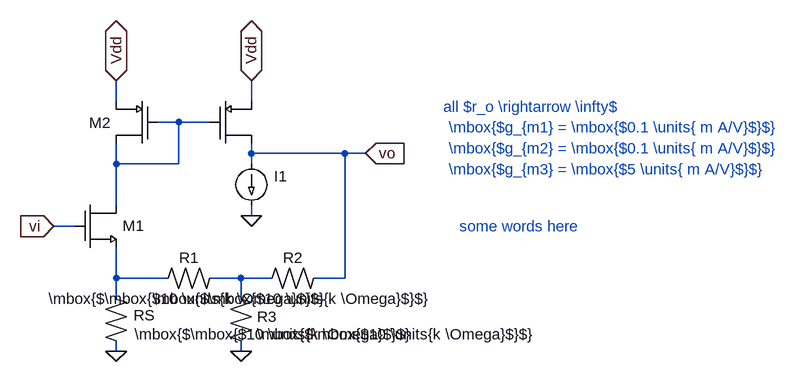
[diagram p0: schematic exampleLatex.asc]
exampleLatex.asc, the LTspice schematic file:
Version 4
SHEET 1 1120 680
WIRE -1008 128 -1008 96
WIRE -800 128 -800 96
WIRE -912 160 -944 160
WIRE -864 160 -912 160
WIRE -800 208 -800 192
WIRE -656 208 -800 208
WIRE -624 208 -656 208
WIRE -1008 224 -1008 192
WIRE -912 224 -912 160
WIRE -912 224 -1008 224
WIRE -800 224 -800 208
WIRE -1008 288 -1008 224
WIRE -800 304 -800 288
WIRE -1072 320 -1104 320
WIRE -1008 400 -1008 352
WIRE -928 400 -1008 400
WIRE -816 400 -864 400
WIRE -768 400 -816 400
WIRE -656 400 -656 208
WIRE -656 400 -704 400
WIRE -1008 432 -1008 400
WIRE -816 432 -816 400
WIRE -1008 512 -1008 496
WIRE -816 512 -816 496
FLAG -800 96 Vdd
IOPIN -800 96 BiDir
FLAG -1008 96 Vdd
IOPIN -1008 96 BiDir
FLAG -800 304 0
FLAG -624 208 vo
IOPIN -624 208 In
FLAG -1104 320 vi
IOPIN -1104 320 In
FLAG -816 512 0
FLAG -1008 512 0
SYMBOL svg_pmos -864 112 R0
WINDOW 0 70 47 Invisible 2
SYMATTR InstName M3
SYMBOL svg/svg_nmos -1072 272 R0
WINDOW 0 74 47 Left 2
SYMATTR InstName M1
SYMBOL svg_pmos -944 112 M0
WINDOW 0 72 49 Left 2
SYMATTR InstName M2
SYMBOL svg/svg_res -1024 432 R0
WINDOW 0 43 25 Left 2
WINDOW 3 44 54 Left 2
SYMATTR InstName RS
SYMATTR Value \mbox{$\mbox{$10 \units{k \Omega}$}$}
SYMBOL svg/svg_res -928 416 R270
WINDOW 0 32 32 VTop 2
WINDOW 3 0 32 VBottom 2
SYMATTR InstName R1
SYMATTR Value \mbox{$\mbox{$10 \units{k \Omega}$}$}
SYMBOL svg/svg_current -800 224 R0
WINDOW 0 35 19 Left 2
WINDOW 3 36 46 Left 2
SYMATTR InstName I1
SYMATTR Value ""
SYMBOL svg/svg_res -768 416 R270
WINDOW 0 32 32 VTop 2
WINDOW 3 0 32 VBottom 2
SYMATTR InstName R2
SYMATTR Value \mbox{$\mbox{$10 \units{k \Omega}$}$}
SYMBOL svg/svg_res -832 432 R0
WINDOW 0 41 27 Left 2
WINDOW 3 41 54 Left 2
SYMATTR InstName R3
SYMATTR Value \mbox{$\mbox{$10 \units{k \Omega}$}$}
TEXT -504 136 Left 2 ;all $r_o \\rightarrow \\infty$
TEXT -496 168 Left 2 ;\\mbox{$g_{m1} = \\mbox{$0.1 \\units{ m A/V}$}$}
TEXT -496 200 Left 2 ;\\mbox{$g_{m2} = \\mbox{$0.1 \\units{ m A/V}$}$}
TEXT -496 232 Left 2 ;\\mbox{$g_{m3} = \\mbox{$5 \\units{ m A/V}$}$}
TEXT -480 320 Left 2 ;some words here

The netlist it stands for:
* exampleLatex.asc
M3 vo N001 Vdd Vdd pmodel W=1E7 L=1E8
M1 N001 vi N002 N002 nmodel W=1E7 L=1E8
M2 N001 N001 Vdd Vdd pmodel W=1E7 L=1E8
RS N002 0 \mbox{$\mbox{$10 \units{k \Omega}$}$}
R1 N002 N003 \mbox{$\mbox{$10 \units{k \Omega}$}$}
I1 vo 0
R2 N003 vo \mbox{$\mbox{$10 \units{k \Omega}$}$}
R3 N003 0 \mbox{$\mbox{$10 \units{k \Omega}$}$}
.model NMOS NMOS
.model PMOS PMOS
.lib standard.mos
* all $r_o \rightarrow \infty$
* \mbox{$g_{m1} = \mbox{$0.1 \units{ m A/V}$}$}
* \mbox{$g_{m2} = \mbox{$0.1 \units{ m A/V}$}$}
* \mbox{$g_{m3} = \mbox{$5 \units{ m A/V}$}$}
* some words here
.backanno
.end